# Altium schematic sheet Encoder_RJ45.SchDoc: STM32F446 CNC
size B; Author: AM; CompanyName: Expatria Technologies; DrawnBy: A.Marles; Engineer: AM; Organization: Expatria Technolgoies; DocumentNumber: 11; Revision: A1; SheetNumber: 11; SheetTotal: 14
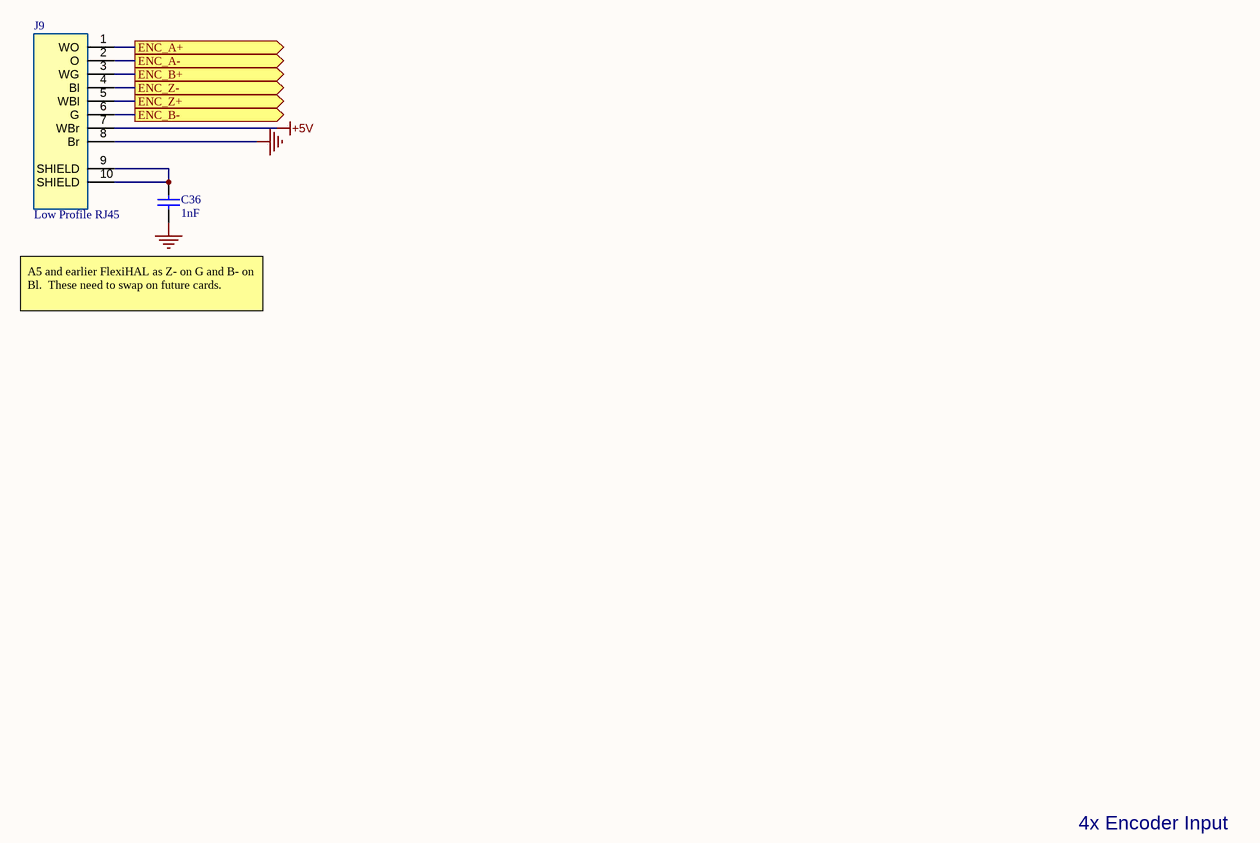
[diagram p0: Encoder_RJ45.SchDoc]

## Parts
C36  1nF  [1206_C]
J9  Low Profile RJ45  [RJ45-SMD_MJ88-B011-HLSV6-P]

## Ports
ENC_A+ (out), ENC_A- (out), ENC_B+ (out), ENC_B- (out), ENC_Z+ (out), ENC_Z- (out)

## Nets
+5V: J9.7(WBr)
GND: C36.1 J9.8(Br)
ENC_A+: J9.1(WO) ; port ENC_A+
ENC_A-: J9.2(O) ; port ENC_A-
ENC_B+: J9.3(WG) ; port ENC_B+
ENC_B-: J9.6(G) ; port ENC_B-
ENC_Z+: J9.5(WBl) ; port ENC_Z+
ENC_Z-: J9.4(Bl) ; port ENC_Z-
NetC36_2: C36.2 J9.9(SHIELD) J9.10(SHIELD)

## Notes on the sheet
- A5 and earlier FlexiHAL as Z- on G and B- on Bl.  These need to swap on future cards.
- 4x Encoder Input
- SHEET
- Expatria Technologies
- 1136 Glade Court
- Port Coquitlam, BC V3B 1R5
- PROJECT
- SIZE
- ENGR
- MODIFIED
- DOCUMENT
- REV
- Copyright Expatria Technologies 2022. This document describes Open Hardware and is licensed under the CERN-OHL-S v2. No warranty is implied or expressed.
- EMAIL: INFO@EXPATRIA.CA
- B
- /

## Library data of the parts
C36 = 1206 1nF (102) 10% 500V: Chip capacitors; Manufacturer: Samsung Electro-Mechanics; PartNumber: CL31B102KGFNNNE; Tolerance: 10%; Voltage: 500V; ComponentLink1Description: Supplier link; ComponentLink1URL: http://www.szlcsc.com/product/details_36187.html; Package: 1206; Supplier: LC; SuppliersPartNumber: C35216; Capacitance: 1nF
J9 = MJ88-B011-HLSV6-P: Micro USB; MF: Heling; SuppliersPartNumber: C501463; Part+Number: MJ88-B011-HLSV6-P